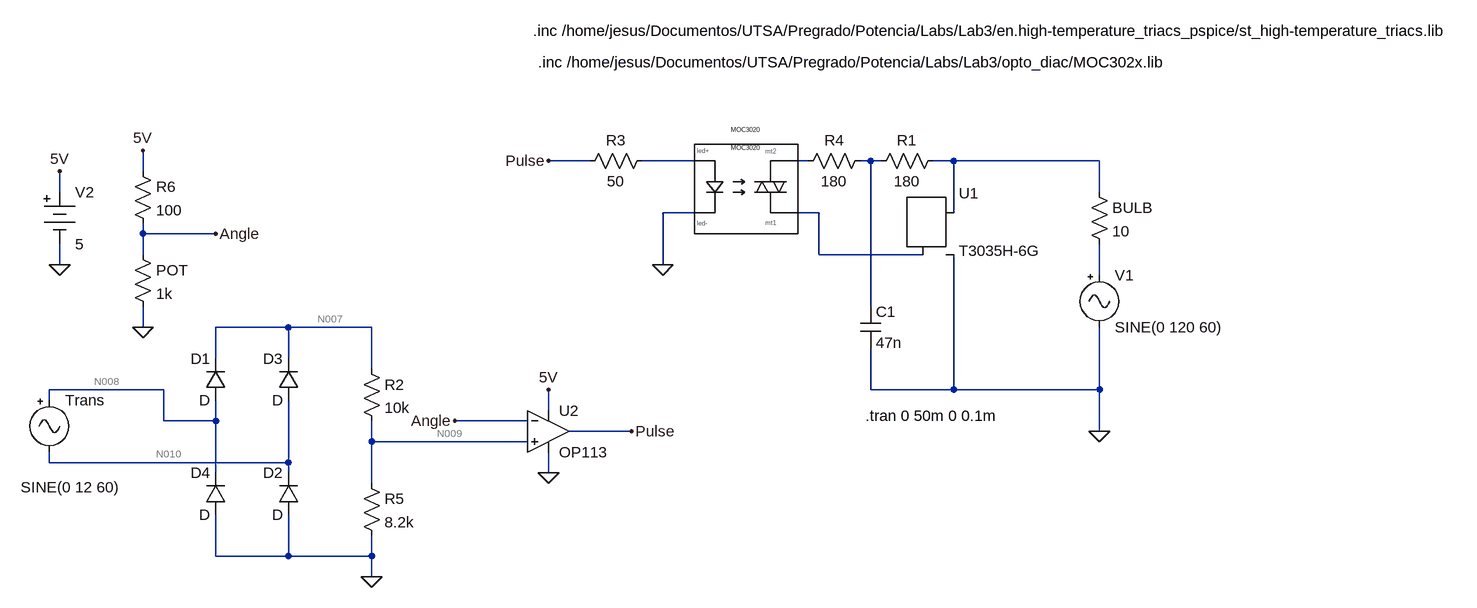
[diagram p0: schematic AC_AC_Converter_Zero_Crossing.asc]
AC_AC_Converter_Zero_Crossing.asc, the LTspice schematic file:
Version 4
SHEET 1 1348 680
WIRE -320 -192 -384 -192
WIRE -160 -192 -240 -192
WIRE 16 -192 0 -192
WIRE 112 -192 96 -192
WIRE 128 -192 112 -192
WIRE 240 -192 208 -192
WIRE 464 -192 240 -192
WIRE -1008 -176 -1008 -208
WIRE -1136 -144 -1136 -176
WIRE 464 -144 464 -192
WIRE -160 -112 -208 -112
WIRE 32 -112 0 -112
WIRE 240 -112 240 -192
WIRE -1008 -80 -1008 -96
WIRE -896 -80 -1008 -80
WIRE -1008 -48 -1008 -80
WIRE 32 -48 32 -112
WIRE 192 -48 32 -48
WIRE -1136 -32 -1136 -64
WIRE -208 -32 -208 -112
WIRE 464 -16 464 -64
WIRE 112 32 112 -192
WIRE -1008 64 -1008 32
WIRE -784 64 -896 64
WIRE -656 64 -784 64
WIRE -896 112 -896 64
WIRE -784 112 -784 64
WIRE -656 128 -656 64
WIRE -976 160 -1152 160
WIRE 112 160 112 96
WIRE 240 160 240 -48
WIRE 240 160 112 160
WIRE 464 160 464 64
WIRE 464 160 240 160
WIRE -1152 176 -1152 160
WIRE -384 192 -384 160
WIRE -976 208 -976 160
WIRE -896 208 -896 176
WIRE -896 208 -976 208
WIRE -416 208 -528 208
WIRE -256 224 -352 224
WIRE 464 224 464 160
WIRE -656 240 -656 208
WIRE -416 240 -656 240
WIRE -1152 272 -1152 256
WIRE -784 272 -784 176
WIRE -784 272 -1152 272
WIRE -896 288 -896 208
WIRE -784 288 -784 272
WIRE -384 288 -384 256
WIRE -656 304 -656 240
WIRE -896 416 -896 352
WIRE -784 416 -784 352
WIRE -784 416 -896 416
WIRE -656 416 -656 384
WIRE -656 416 -784 416
WIRE -656 448 -656 416
FLAG -208 -32 0
FLAG 464 224 0
FLAG -384 -192 Pulse
FLAG -656 448 0
FLAG -1136 -32 0
FLAG -1136 -176 5V
FLAG -384 160 5V
FLAG -384 288 0
FLAG -256 224 Pulse
FLAG -1008 -208 5V
FLAG -1008 64 0
FLAG -896 -80 Angle
FLAG -528 208 Angle
SYMBOL Misc\\signal 464 -32 R0
WINDOW 123 0 0 Left 0
WINDOW 39 0 0 Left 0
SYMATTR InstName V1
SYMATTR Value SINE(0 120 60)
SYMBOL res 448 -160 R0
SYMATTR InstName BULB
SYMATTR Value 10
SYMBOL Optos\\LED_TRIAC -112 -176 R0
WINDOW 38 32 112 Invisible 0
WINDOW 3 32 -36 Center 0
SYMATTR SpiceModel ""
SYMATTR Value MOC3020
SYMATTR InstName MOC3020
SYMBOL Misc\\TRIAC 208 -112 R0
SYMATTR InstName U1
SYMATTR Value T3035H-6G
SYMBOL res 224 -208 R90
WINDOW 0 0 56 VBottom 2
WINDOW 3 32 56 VTop 2
SYMATTR InstName R1
SYMATTR Value 180
SYMBOL res -224 -208 R90
WINDOW 0 0 56 VBottom 2
WINDOW 3 32 56 VTop 2
SYMATTR InstName R3
SYMATTR Value 50
SYMBOL res 112 -208 R90
WINDOW 0 0 56 VBottom 2
WINDOW 3 32 56 VTop 2
SYMATTR InstName R4
SYMATTR Value 180
SYMBOL cap 96 32 R0
SYMATTR InstName C1
SYMATTR Value 47n
SYMBOL OpAmps\\OP113 -384 160 R0
SYMATTR InstName U2
SYMBOL Misc\\signal -1152 160 R0
WINDOW 123 0 0 Left 0
WINDOW 39 0 0 Left 0
WINDOW 3 -44 150 Left 2
SYMATTR Value SINE(0 12 60)
SYMATTR InstName Trans
SYMBOL res -672 112 R0
SYMATTR InstName R2
SYMATTR Value 10k
SYMBOL res -672 288 R0
SYMATTR InstName R5
SYMATTR Value 8.2k
SYMBOL Misc\\battery -1136 -160 R0
WINDOW 123 0 0 Left 0
WINDOW 39 0 0 Left 0
SYMATTR InstName V2
SYMATTR Value 5
SYMBOL diode -880 176 R180
WINDOW 0 24 64 Left 2
WINDOW 3 24 0 Left 2
SYMATTR InstName D1
SYMBOL diode -768 352 R180
WINDOW 0 24 64 Left 2
WINDOW 3 24 0 Left 2
SYMATTR InstName D2
SYMBOL diode -768 176 R180
WINDOW 0 24 64 Left 2
WINDOW 3 24 0 Left 2
SYMATTR InstName D3
SYMBOL diode -880 352 R180
WINDOW 0 24 64 Left 2
WINDOW 3 24 0 Left 2
SYMATTR InstName D4
SYMBOL res -1024 -192 R0
SYMATTR InstName R6
SYMATTR Value 100
SYMBOL res -1024 -64 R0
SYMATTR InstName POT
SYMATTR Value 1k
TEXT 104 200 Left 2 !.tran 0 50m 0 0.1m
TEXT -408 -392 Left 2 !.inc /home/jesus/Documentos/UTSA/Pregrado/Potencia/Labs/Lab3/en.high-temperature_triacs_pspice/st_high-temperature_triacs.lib
TEXT -400 -344 Left 2 !.inc /home/jesus/Documentos/UTSA/Pregrado/Potencia/Labs/Lab3/opto_diac/MOC302x.lib

The netlist it stands for:
* AC_AC_Converter_Zero_Crossing.asc
V1 N006 0 SINE(0 120 60)
R§BULB N004 N006 10
XMOC3020 N001 0 N002 N005 MOC3020  ; pins led+ led- mt2 mt1
XU1 N004 N005 0 T3035H-6G  ; pins MT2 G MT1
R1 N004 N003 180
R3 N001 Pulse 50
R4 N003 N002 180
C1 N003 0 47n
XU2 N009 Angle 5V 0 Pulse OP113  ; pins In+ In- V+ V- OUT
V§Trans N008 N010 SINE(0 12 60)
R2 N007 N009 10k
R5 N009 0 8.2k
V2 5V 0 5
D1 N008 N007 D
D2 0 N010 D
D3 N010 N007 D
D4 0 N008 D
R6 5V Angle 100
R§POT Angle 0 1k
.model D D
.lib standard.dio
.tran 0 50m 0 0.1m
.inc /home/jesus/Documentos/UTSA/Pregrado/Potencia/Labs/Lab3/en.high-temperature_triacs_pspice/st_high-temperature_triacs.lib
.inc /home/jesus/Documentos/UTSA/Pregrado/Potencia/Labs/Lab3/opto_diac/MOC302x.lib
.lib ADI.lib
.backanno
.end

* Results of the author's LTspice run, read from the files saved beside the schematic
* Operating Point, zero values left out:
*   V(5v) = 5 V
*   V(angle) = 4.545 V
*   V(n009) = 4.138 mV
*   V(n008) = 2.069 mV
*   V(n010) = 2.069 mV
*   V(n007) = 4.138 mV
*   I(Pot) = 4.545 mA
*   I(R6) = 4.545 mA
*   I(R5) = 504.6 nA
*   I(V2) = -5.305 mA
*   Ix(u2:3) = -504.6 nA
*   Ix(u2:2) = 25.01 nA
*   Ix(u2:7) = 759.2 µA
*   Ix(u2:4) = -758.8 µA
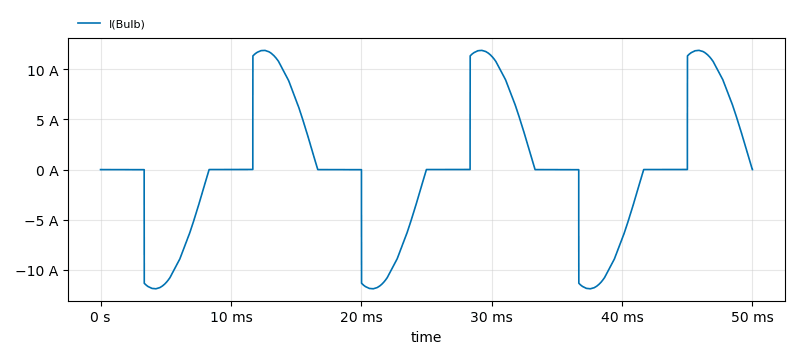
[diagram p1: Transient Analysis of AC_AC_Converter_Zero_Crossing.asc, plotted from the saved traces]
* Transient Analysis, 1 run:
*   I(Bulb): min -11.9 A, max 11.9 A, average 84.25 µA, rms 6.984 A, last -1.63 mA